# Altium schematic sheet EtherCATConnectors.SchDoc
size 420 x 297 mm; SheetNumber: 8; SheetTotal: 14; PageSetup: Record=PageOptions|CenterHorizontal=True|CenterVertical=True|PrintScale=0.96|XCorrection=1.00|YCorrection=1.00|PrintKind=1|BorderSize=5000000|LeftOffset=0|BottomOffset=0|Orientation=2|PaperLength=4318|PaperWidth=2794|Scale=100|PaperSource=7|PrintQuality=600|MediaType=1|DitherType=10|PaperKind=11" x 17"|PrintScaleMode=1
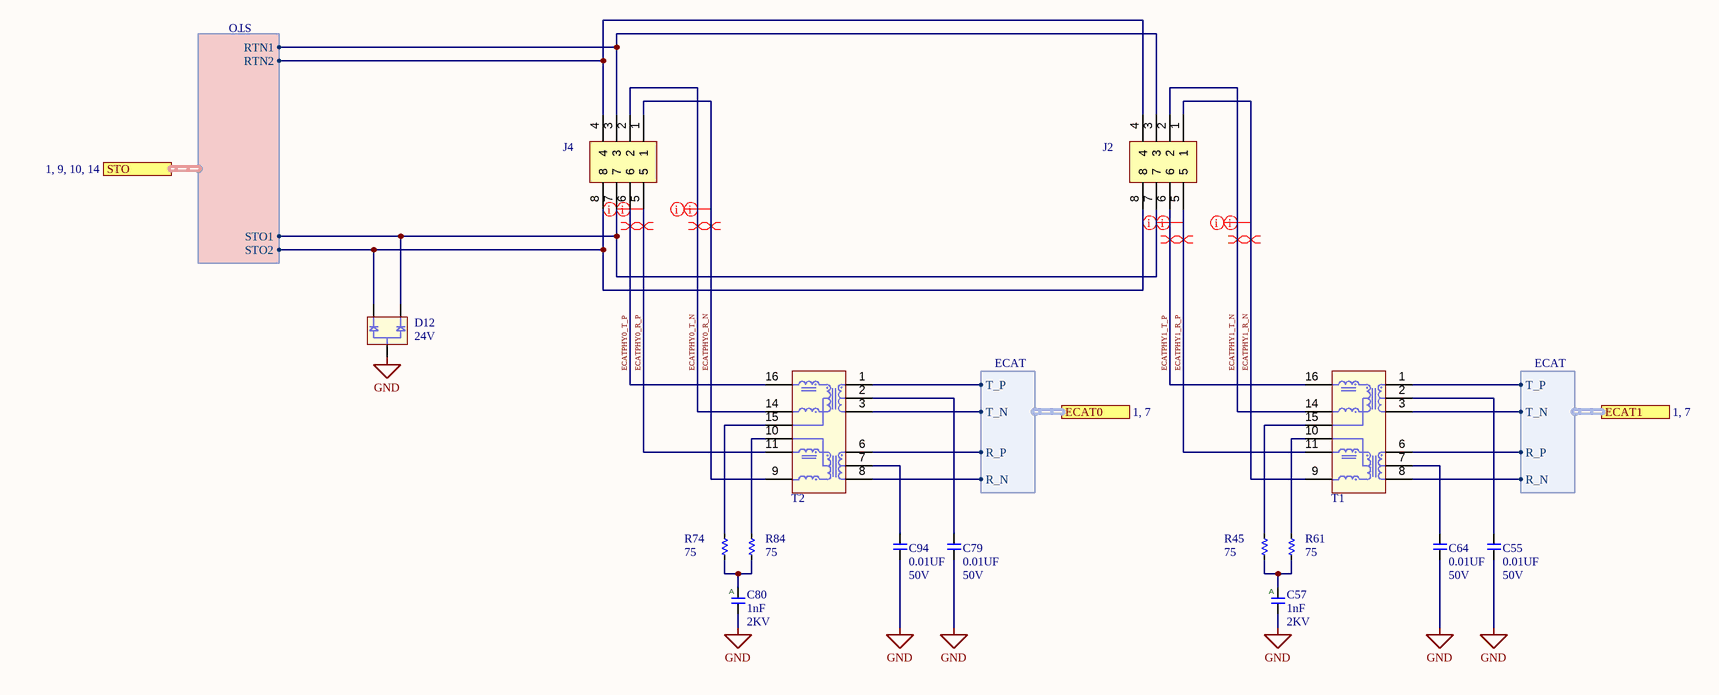
[diagram p0: EtherCATConnectors.SchDoc]

## Parts
C55  value 0.01UF  Voltage: 50V  [C0402]  (hidden comment: __Template_Cap)
C57  value 1nF  Voltage: 2KV  [C1210]  (hidden comment: __Template_Cap_Auto)
C64  value 0.01UF  Voltage: 50V  [C0402]  (hidden comment: __Template_Cap)
C79  value 0.01UF  Voltage: 50V  [C0402]  (hidden comment: __Template_Cap)
C80  value 1nF  Voltage: 2KV  [C1210]  (hidden comment: __Template_Cap_Auto)
C94  value 0.01UF  Voltage: 50V  [C0402]  (hidden comment: __Template_Cap)
D12  24V  [3SOT23]
J2  MOLEX_2X4_NANOFIT_1053141308  [MOLEX_1053141308]  (value not drawn)
J4  MOLEX_2X4_NANOFIT_1053141308  [MOLEX_1053141308]  (value not drawn)
R45  75  [R0402]
R61  75  [R0402]
R74  75  [R0402]
R84  75  [R0402]
T1  PULSE_H1102NL  [PULSE_HXXXX]  (value not drawn)
T2  PULSE_H1102NL  [PULSE_HXXXX]  (value not drawn)

## Ports
ECAT0 (harness ECAT, see 1, 7), ECAT1 (harness ECAT, see 1, 7), STO (harness STO, see 1, 9, 10, 14)

## Harnesses
ECAT: R_P, R_N, T_P, T_N
STO: STO1, RTN2, STO2, RTN1

## Nets
GND: C55.2 C57.2 C64.2 C79.2 C80.2 C94.2 D12.3
ECATPHY0_R_N: J4.1 T2.9
ECATPHY0_R_P: J4.5 T2.11
ECATPHY0_T_N: J4.2 T2.14
ECATPHY0_T_P: J4.6 T2.16
ECATPHY1_R_N: J2.1 T1.9
ECATPHY1_R_P: J2.5 T1.11
ECATPHY1_T_N: J2.2 T1.14
ECATPHY1_T_P: J2.6 T1.16
NetC55_1: C55.1 T1.2
NetC57_1: C57.1 R45.1 R61.1
NetC64_1: C64.1 T1.7
NetC79_1: C79.1 T2.2
NetC80_1: C80.1 R74.1 R84.1
NetC94_1: C94.1 T2.7
NetD12_1: D12.1 J2.7 J4.7 ; port STO.STO1
NetD12_2: D12.2 J2.8 J4.8 ; port STO.STO2
NetJ2_3: J2.3 J4.3 ; port STO.RTN1
NetJ2_4: J2.4 J4.4 ; port STO.RTN2
NetR45_2: R45.2 T1.15
NetR61_2: R61.2 T1.10
NetR74_2: R74.2 T2.15
NetR84_2: R84.2 T2.10
NetT1_1: T1.1 ; port ECAT1.T_P
NetT1_3: T1.3 ; port ECAT1.T_N
NetT1_6: T1.6 ; port ECAT1.R_P
NetT1_8: T1.8 ; port ECAT1.R_N
NetT2_1: T2.1 ; port ECAT0.T_P
NetT2_3: T2.3 ; port ECAT0.T_N
NetT2_6: T2.6 ; port ECAT0.R_P
NetT2_8: T2.8 ; port ECAT0.R_N

## Layout directives
differential pair; differential pair class 100Ohm: ECATPHY0_R_N, ECATPHY0_R_P, ECATPHY0_T_N, ECATPHY0_T_P, ECATPHY1_R_N, ECATPHY1_R_P, ECATPHY1_T_N, ECATPHY1_T_P
net class Diff100Ohm: ECATPHY0_R_N, ECATPHY0_R_P, ECATPHY0_T_N, ECATPHY0_T_P, ECATPHY1_R_N, ECATPHY1_R_P, ECATPHY1_T_N, ECATPHY1_T_P

## Notes on the sheet
- CREATIVE COMMONS
- PUBLIC LICENSE:
- BARKOUR ROBOT
- CC BY-NC 4.0
- APPROVED
- DWG NO
- GOOGLE LLC
- FILE
- RELEASED
- 2024/05/09
- SIZE
- 1600 AMPHITHEATRE PARKWAY
- MOUNTAIN VIEW CA 94043
- A3
- SHEET
- OF
- THIS DESIGN IS BEING PROVIDED  FOR NON-COMMERCIAL USE ONLY. THE USE OF =SCIENTIST_NAME_POSSESSIVE NAME IN CONNECTION WITH THE DESIGN IS NOT INTENDED TO IMPLY THAT =SCIENTIST_NAME SPONSORS OR ENDORSES THE DESIGN, GOOGLE LLC, OR ANY OF GOOGLE LLC'S PRODUCTS OR SERVICES.
- (in symbol 6) A

## Library data of the parts
C55 C64 C79 C94 = 625: CAP, CER, X7R, 0.01uF, 50V, 20%, 0402, 0.56mm T; MFG: KEMET; MFG P/N: C0402C103M5RACTU; COMMON: 150-00227-00; Status: Released; Package: 0402; Supplier 1: Digi-Key; ComponentLink1URL: https://www.digikey.com/en/products/detail/kemet/C0402C103M5RAC7867/2196227; Supplier Part Number 1: 399-C0402C103M5RAC7867CT-ND
C57 C80 = 6: CAP, CER, X7S, 1000PF, 2KV, 10%, 1210; MFG: TDK; MFG P/N: CGA6M1X7S3D102K200AA; COMMON: 150-01098-00; Status: Released; Package: 1210; Supplier 1: Digi-Key; ComponentLink1URL: https://www.digikey.com/en/products/detail/tdk-corporation/CGA6M1X7S3D102K200AA/3950274; Supplier Part Number 1: 445-13038-1-ND
D12 = 176: DIODE, TVS, UNIDIR, DUAL, 24VRWM, 26VBR, 41VCL, SOT-23-3; MFG: Infineon Technologies; MFG P/N: ESD24VS2UE6327HTSA1; Value: ESD24VS2UE6327HTSA1; Status: Released; Package: TO-236-3, SC-59, SOT-23-3; Supplier 1: Digi-Key; ComponentLink1URL: https://www.infineon.com/dgdl/Infineon-ESD24VS2U-DS-v01_01-en.pdf?fileId=db3a3043340fff53013413a2249d2ff3; Supplier Part Number 1: ESD24VS2UE6327HTSA1CT-ND
J2 J4 = MOLEX_2X4_NANOFIT_1053141308: CONN HEADER R/A 8POS 2.5MM; MFG: Molex; Supplier 1: Digi-Key; Supplier Part Number 1: WM15168-ND; ComponentLink1URL: https://www.digikey.com/en/products/detail/molex/1053141308/6164257; MFG P/N: 1053141308; Value: 1053141308
R45 R61 R74 R84 = 2283: RES, 75, 1%, 1/16W, 0402; MFG: YAGEO; MFG P/N: RC0402FR-0775RL; COMMON: 470-00607-00; Status: Released; Package: 0402; Value: 75; Supplier 1: Digi-Key; ComponentLink1URL: https://www.digikey.com/en/products/detail/yageo/RC0402FR-0775RL/726658; Supplier Part Number 1: 311-75.0LRCT-ND
T1 T2 = PULSE_H1102NL: Telecom Transformer 2(1:1) 0.65Ohm Prim. DCR 0.65Ohm Sec. DCR 16 Terminal Gull Wing SMD; MFG: Pulse Electronics; Supplier 1: Digi-Key; Supplier Part Number 1: 553-1323-5-ND; ComponentLink1URL: https://datasheet.ciiva.com/2938/10-100base-tsingleportsmdmagnetics-rev2008-2938779.pdf?src-supplier=Digi-Key; MFG P/N: H1102NL; Value: H1102NL